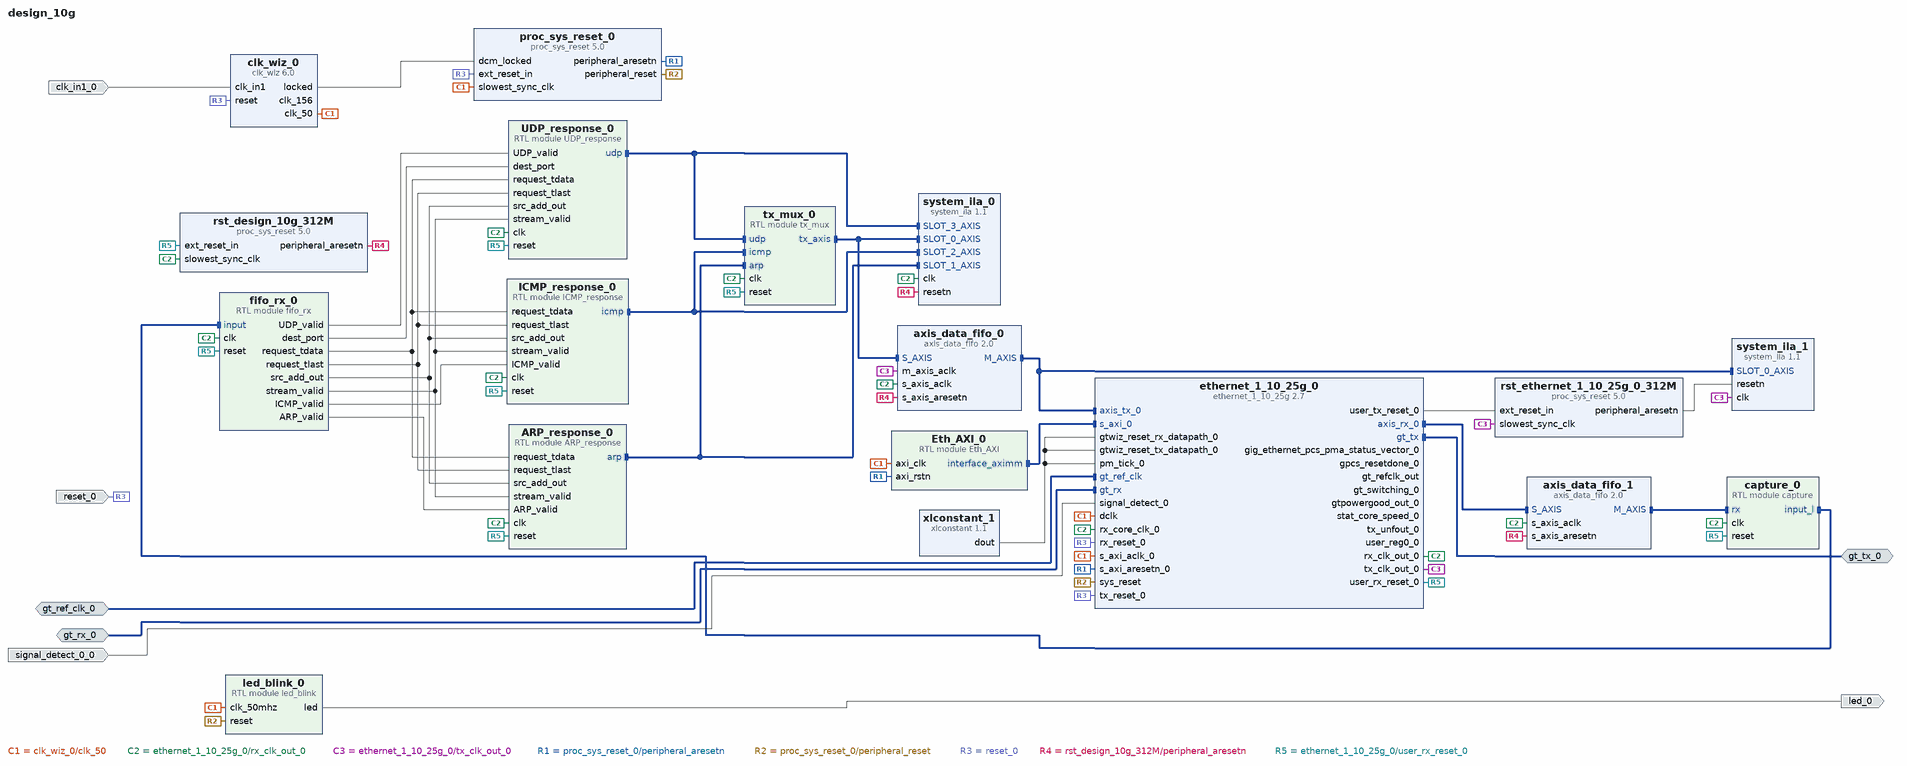
[diagram p0: block diagram of the top level]
# Vivado block design design_10g, xcku085-flvf1924-2-i, Vivado 2021.1
create_bd_design design_10g

create_bd_intf_port -mode Slave -vlnv xilinx.com:interface:diff_clock_rtl:1.0 gt_ref_clk_0
set_property -dict {CONFIG.FREQ_HZ 156250000} [get_bd_intf_ports gt_ref_clk_0]
create_bd_intf_port -mode Slave -vlnv xilinx.com:display_ethernet_1_10_25g:gt_ports:2.0 gt_rx_0
create_bd_intf_port -mode Master -vlnv xilinx.com:display_ethernet_1_10_25g:gt_ports:2.0 gt_tx_0
create_bd_port -dir I -type rst reset_0
set_property -dict {CONFIG.POLARITY ACTIVE_HIGH} [get_bd_ports reset_0]
create_bd_port -dir O led_0
create_bd_port -dir I -type clk clk_in1_0
set_property -dict {CONFIG.FREQ_HZ 20000000} [get_bd_ports clk_in1_0]
create_bd_port -dir I signal_detect_0_0

create_bd_cell -type ip -vlnv xilinx.com:ip:clk_wiz:6.0 clk_wiz_0
set_property -dict [list \
  CONFIG.CLKIN1_JITTER_PS 500.0 \
  CONFIG.CLKOUT1_JITTER 198.455 \
  CONFIG.CLKOUT1_PHASE_ERROR 309.974 \
  CONFIG.CLKOUT1_REQUESTED_OUT_FREQ 156.250 \
  CONFIG.CLKOUT2_JITTER 225.529 \
  CONFIG.CLKOUT2_PHASE_ERROR 309.974 \
  CONFIG.CLKOUT2_REQUESTED_OUT_FREQ 50.000 \
  CONFIG.CLKOUT2_USED true \
  CONFIG.CLK_OUT1_PORT clk_156 \
  CONFIG.CLK_OUT2_PORT clk_50 \
  CONFIG.MMCM_CLKFBOUT_MULT_F 62.500 \
  CONFIG.MMCM_CLKIN1_PERIOD 50.000 \
  CONFIG.MMCM_CLKIN2_PERIOD 10.0 \
  CONFIG.MMCM_CLKOUT0_DIVIDE_F 8.000 \
  CONFIG.MMCM_CLKOUT1_DIVIDE 25 \
  CONFIG.MMCM_DIVCLK_DIVIDE 1 \
  CONFIG.NUM_OUT_CLKS 2 \
  CONFIG.PRIM_IN_FREQ 20.000 \
  CONFIG.PRIM_SOURCE Single_ended_clock_capable_pin \
] [get_bd_cells clk_wiz_0]
create_bd_cell -type ip -vlnv xilinx.com:ip:ethernet_1_10_25g:2.7 ethernet_1_10_25g_0
set_property -dict [list \
  CONFIG.ADD_GT_CNTRL_STS_PORTS 0 \
  CONFIG.CORE {Ethernet MAC+PCS/PMA 32-bit} \
  CONFIG.GT_DRP_CLK 50.00 \
  CONFIG.GT_GROUP_SELECT Quad_X0Y4 \
  CONFIG.LANE1_GT_LOC X0Y19 \
] [get_bd_cells ethernet_1_10_25g_0]
create_bd_cell -type ip -vlnv xilinx.com:ip:proc_sys_reset:5.0 proc_sys_reset_0
create_bd_cell -type ip -vlnv xilinx.com:ip:xlconstant:1.1 xlconstant_1
set_property -dict {CONFIG.CONST_VAL 0} [get_bd_cells xlconstant_1]
create_bd_cell -type ip -vlnv xilinx.com:ip:proc_sys_reset:5.0 rst_design_10g_312M
create_bd_cell -type module -reference led_blink led_blink_0
create_bd_cell -type ip -vlnv xilinx.com:ip:proc_sys_reset:5.0 rst_ethernet_1_10_25g_0_312M
create_bd_cell -type ip -vlnv xilinx.com:ip:system_ila:1.1 system_ila_0
set_property -dict [list \
  CONFIG.ALL_PROBE_SAME_MU_CNT 2 \
  CONFIG.C_EN_STRG_QUAL 1 \
  CONFIG.C_MON_TYPE INTERFACE \
  CONFIG.C_NUM_MONITOR_SLOTS 4 \
  CONFIG.C_NUM_OF_PROBES 1 \
  CONFIG.C_PROBE0_MU_CNT 2 \
  CONFIG.C_PROBE0_TYPE 0 \
  CONFIG.C_PROBE1_TYPE 0 \
  CONFIG.C_PROBE2_TYPE 0 \
  CONFIG.C_PROBE3_TYPE 0 \
  CONFIG.C_PROBE4_TYPE 0 \
  CONFIG.C_PROBE5_TYPE 0 \
  CONFIG.C_SLOT_0_APC_EN 0 \
  CONFIG.C_SLOT_0_AXI_DATA_SEL 1 \
  CONFIG.C_SLOT_0_AXI_TRIG_SEL 1 \
  CONFIG.C_SLOT_0_INTF_TYPE xilinx.com:interface:axis_rtl:1.0 \
  CONFIG.C_SLOT_0_TYPE 0 \
  CONFIG.C_SLOT_1_APC_EN 0 \
  CONFIG.C_SLOT_1_AXI_DATA_SEL 1 \
  CONFIG.C_SLOT_1_AXI_TRIG_SEL 1 \
  CONFIG.C_SLOT_1_INTF_TYPE xilinx.com:interface:axis_rtl:1.0 \
  CONFIG.C_SLOT_2_APC_EN 0 \
  CONFIG.C_SLOT_2_AXI_DATA_SEL 1 \
  CONFIG.C_SLOT_2_AXI_TRIG_SEL 1 \
  CONFIG.C_SLOT_2_INTF_TYPE xilinx.com:interface:axis_rtl:1.0 \
  CONFIG.C_SLOT_3_APC_EN 0 \
  CONFIG.C_SLOT_3_AXI_DATA_SEL 1 \
  CONFIG.C_SLOT_3_AXI_TRIG_SEL 1 \
  CONFIG.C_SLOT_3_INTF_TYPE xilinx.com:interface:axis_rtl:1.0 \
] [get_bd_cells system_ila_0]
create_bd_cell -type ip -vlnv xilinx.com:ip:axis_data_fifo:2.0 axis_data_fifo_0
set_property -dict {CONFIG.IS_ACLK_ASYNC 1} [get_bd_cells axis_data_fifo_0]
create_bd_cell -type ip -vlnv xilinx.com:ip:axis_data_fifo:2.0 axis_data_fifo_1
create_bd_cell -type module -reference ARP_response ARP_response_0
create_bd_cell -type module -reference ICMP_response ICMP_response_0
create_bd_cell -type module -reference Eth_AXI Eth_AXI_0
create_bd_cell -type module -reference capture capture_0
create_bd_cell -type module -reference fifo_rx fifo_rx_0
create_bd_cell -type module -reference tx_mux tx_mux_0
create_bd_cell -type ip -vlnv xilinx.com:ip:system_ila:1.1 system_ila_1
set_property -dict [list \
  CONFIG.C_MON_TYPE INTERFACE \
  CONFIG.C_NUM_MONITOR_SLOTS 1 \
  CONFIG.C_SLOT_0_APC_EN 1 \
  CONFIG.C_SLOT_0_AXI_DATA_SEL 1 \
  CONFIG.C_SLOT_0_AXI_TRIG_SEL 1 \
  CONFIG.C_SLOT_0_INTF_TYPE xilinx.com:interface:axis_rtl:1.0 \
] [get_bd_cells system_ila_1]
create_bd_cell -type module -reference UDP_response UDP_response_0

# ---- connections ----

connect_bd_intf_net -intf_net ARP_response_0_arp [get_bd_intf_pins tx_mux_0/arp] [get_bd_intf_pins ARP_response_0/arp]
connect_bd_intf_net [get_bd_intf_pins tx_mux_0/arp] [get_bd_intf_pins system_ila_0/SLOT_1_AXIS]
connect_bd_intf_net [get_bd_intf_pins Eth_AXI_0/interface_aximm] [get_bd_intf_pins ethernet_1_10_25g_0/s_axi_0]
connect_bd_intf_net -intf_net ICMP_response_0_icmp [get_bd_intf_pins tx_mux_0/icmp] [get_bd_intf_pins ICMP_response_0/icmp]
connect_bd_intf_net [get_bd_intf_pins tx_mux_0/icmp] [get_bd_intf_pins system_ila_0/SLOT_2_AXIS]
connect_bd_intf_net -intf_net UDP_response_0_udp [get_bd_intf_pins tx_mux_0/udp] [get_bd_intf_pins UDP_response_0/udp]
connect_bd_intf_net [get_bd_intf_pins tx_mux_0/udp] [get_bd_intf_pins system_ila_0/SLOT_3_AXIS]
connect_bd_intf_net -intf_net axis_data_fifo_0_M_AXIS [get_bd_intf_pins axis_data_fifo_0/M_AXIS] [get_bd_intf_pins ethernet_1_10_25g_0/axis_tx_0]
connect_bd_intf_net [get_bd_intf_pins axis_data_fifo_0/M_AXIS] [get_bd_intf_pins system_ila_1/SLOT_0_AXIS]
connect_bd_intf_net [get_bd_intf_pins axis_data_fifo_1/M_AXIS] [get_bd_intf_pins capture_0/rx]
connect_bd_intf_net [get_bd_intf_pins fifo_rx_0/input] [get_bd_intf_pins capture_0/input_l]
connect_bd_intf_net [get_bd_intf_pins axis_data_fifo_1/S_AXIS] [get_bd_intf_pins ethernet_1_10_25g_0/axis_rx_0]
connect_bd_intf_net [get_bd_intf_ports gt_tx_0] [get_bd_intf_pins ethernet_1_10_25g_0/gt_tx]
connect_bd_intf_net -intf_net gt_ref_clk_0_1 [get_bd_intf_ports gt_ref_clk_0] [get_bd_intf_pins ethernet_1_10_25g_0/gt_ref_clk]
connect_bd_intf_net -intf_net gt_rx_0_1 [get_bd_intf_ports gt_rx_0] [get_bd_intf_pins ethernet_1_10_25g_0/gt_rx]
connect_bd_intf_net -intf_net tx_mux_0_tx_axis [get_bd_intf_pins axis_data_fifo_0/S_AXIS] [get_bd_intf_pins tx_mux_0/tx_axis]
connect_bd_intf_net [get_bd_intf_pins axis_data_fifo_0/S_AXIS] [get_bd_intf_pins system_ila_0/SLOT_0_AXIS]
connect_bd_net -net clk_in1_0_1 [get_bd_ports clk_in1_0] [get_bd_pins clk_wiz_0/clk_in1]
connect_bd_net [get_bd_pins clk_wiz_0/clk_50] \
  [get_bd_pins ethernet_1_10_25g_0/dclk] [get_bd_pins ethernet_1_10_25g_0/s_axi_aclk_0] \
  [get_bd_pins proc_sys_reset_0/slowest_sync_clk] [get_bd_pins led_blink_0/clk_50mhz] [get_bd_pins Eth_AXI_0/axi_clk]
# net clk_wiz_0_clk_156 has one end: clk_wiz_0/clk_156
connect_bd_net [get_bd_pins clk_wiz_0/locked] [get_bd_pins proc_sys_reset_0/dcm_locked]
connect_bd_net [get_bd_pins ethernet_1_10_25g_0/rx_clk_out_0] \
  [get_bd_pins ethernet_1_10_25g_0/rx_core_clk_0] [get_bd_pins rst_design_10g_312M/slowest_sync_clk] \
  [get_bd_pins system_ila_0/clk] [get_bd_pins axis_data_fifo_0/s_axis_aclk] [get_bd_pins axis_data_fifo_1/s_axis_aclk] \
  [get_bd_pins ARP_response_0/clk] [get_bd_pins ICMP_response_0/clk] [get_bd_pins capture_0/clk] [get_bd_pins fifo_rx_0/clk] \
  [get_bd_pins tx_mux_0/clk] [get_bd_pins UDP_response_0/clk]
connect_bd_net [get_bd_pins ethernet_1_10_25g_0/tx_clk_out_0] \
  [get_bd_pins rst_ethernet_1_10_25g_0_312M/slowest_sync_clk] [get_bd_pins axis_data_fifo_0/m_axis_aclk] \
  [get_bd_pins system_ila_1/clk]
connect_bd_net [get_bd_pins fifo_rx_0/ARP_valid] [get_bd_pins ARP_response_0/ARP_valid]
connect_bd_net [get_bd_pins fifo_rx_0/ICMP_valid] [get_bd_pins ICMP_response_0/ICMP_valid]
connect_bd_net [get_bd_pins fifo_rx_0/UDP_valid] [get_bd_pins UDP_response_0/UDP_valid]
connect_bd_net [get_bd_pins fifo_rx_0/dest_port] [get_bd_pins UDP_response_0/dest_port]
connect_bd_net [get_bd_pins fifo_rx_0/request_tdata] \
  [get_bd_pins ARP_response_0/request_tdata] [get_bd_pins ICMP_response_0/request_tdata] \
  [get_bd_pins UDP_response_0/request_tdata]
connect_bd_net [get_bd_pins fifo_rx_0/request_tlast] \
  [get_bd_pins ARP_response_0/request_tlast] [get_bd_pins ICMP_response_0/request_tlast] \
  [get_bd_pins UDP_response_0/request_tlast]
connect_bd_net [get_bd_pins fifo_rx_0/src_add_out] \
  [get_bd_pins ARP_response_0/src_add_out] [get_bd_pins ICMP_response_0/src_add_out] [get_bd_pins UDP_response_0/src_add_out]
connect_bd_net [get_bd_pins fifo_rx_0/stream_valid] \
  [get_bd_pins ARP_response_0/stream_valid] [get_bd_pins ICMP_response_0/stream_valid] \
  [get_bd_pins UDP_response_0/stream_valid]
# net gig_ethernet_pcs_pma_status_vector_0 has one end: ethernet_1_10_25g_0/gig_ethernet_pcs_pma_status_vector_0
# net gpcs_resetdone_0 has one end: ethernet_1_10_25g_0/gpcs_resetdone_0
# net gt_refclk_out has one end: ethernet_1_10_25g_0/gt_refclk_out
# net gt_switching_0 has one end: ethernet_1_10_25g_0/gt_switching_0
# net gtpowergood_out_0 has one end: ethernet_1_10_25g_0/gtpowergood_out_0
connect_bd_net [get_bd_pins led_blink_0/led] [get_bd_ports led_0]
connect_bd_net [get_bd_pins proc_sys_reset_0/peripheral_aresetn] [get_bd_pins ethernet_1_10_25g_0/s_axi_aresetn_0] [get_bd_pins Eth_AXI_0/axi_rstn]
connect_bd_net [get_bd_pins proc_sys_reset_0/peripheral_reset] [get_bd_pins ethernet_1_10_25g_0/sys_reset] [get_bd_pins led_blink_0/reset]
connect_bd_net -net reset_0_1 [get_bd_ports reset_0] \
  [get_bd_pins clk_wiz_0/reset] [get_bd_pins ethernet_1_10_25g_0/tx_reset_0] [get_bd_pins proc_sys_reset_0/ext_reset_in] \
  [get_bd_pins ethernet_1_10_25g_0/rx_reset_0]
connect_bd_net [get_bd_pins rst_design_10g_312M/peripheral_aresetn] \
  [get_bd_pins axis_data_fifo_1/s_axis_aresetn] [get_bd_pins system_ila_0/resetn] \
  [get_bd_pins axis_data_fifo_0/s_axis_aresetn]
connect_bd_net [get_bd_pins rst_ethernet_1_10_25g_0_312M/peripheral_aresetn] [get_bd_pins system_ila_1/resetn]
connect_bd_net -net signal_detect_0_0_1 [get_bd_ports signal_detect_0_0] [get_bd_pins ethernet_1_10_25g_0/signal_detect_0]
# net stat_core_speed_0 has one end: ethernet_1_10_25g_0/stat_core_speed_0
# net tx_unfout_0 has one end: ethernet_1_10_25g_0/tx_unfout_0
# net user_reg0_0 has one end: ethernet_1_10_25g_0/user_reg0_0
connect_bd_net -net user_rx_reset_0 [get_bd_pins ethernet_1_10_25g_0/user_rx_reset_0] \
  [get_bd_pins ARP_response_0/reset] [get_bd_pins ICMP_response_0/reset] [get_bd_pins rst_design_10g_312M/ext_reset_in] \
  [get_bd_pins capture_0/reset] [get_bd_pins fifo_rx_0/reset] [get_bd_pins tx_mux_0/reset] [get_bd_pins UDP_response_0/reset]
connect_bd_net -net user_tx_reset_0 [get_bd_pins ethernet_1_10_25g_0/user_tx_reset_0] [get_bd_pins rst_ethernet_1_10_25g_0_312M/ext_reset_in]
connect_bd_net [get_bd_pins xlconstant_1/dout] \
  [get_bd_pins ethernet_1_10_25g_0/gtwiz_reset_tx_datapath_0] [get_bd_pins ethernet_1_10_25g_0/gtwiz_reset_rx_datapath_0] \
  [get_bd_pins ethernet_1_10_25g_0/pm_tick_0]
set_property HDL_ATTRIBUTE.DEBUG true [get_bd_intf_nets ARP_response_0_arp]
set_property HDL_ATTRIBUTE.MARK_DEBUG true [get_bd_intf_nets ARP_response_0_arp]
set_property HDL_ATTRIBUTE.DEBUG true [get_bd_intf_nets ICMP_response_0_icmp]
set_property HDL_ATTRIBUTE.MARK_DEBUG true [get_bd_intf_nets ICMP_response_0_icmp]
set_property HDL_ATTRIBUTE.DEBUG true [get_bd_intf_nets UDP_response_0_udp]
set_property HDL_ATTRIBUTE.MARK_DEBUG true [get_bd_intf_nets UDP_response_0_udp]
set_property HDL_ATTRIBUTE.DEBUG true [get_bd_intf_nets axis_data_fifo_0_M_AXIS]
set_property HDL_ATTRIBUTE.MARK_DEBUG true [get_bd_intf_nets axis_data_fifo_0_M_AXIS]
set_property HDL_ATTRIBUTE.DEBUG true [get_bd_intf_nets tx_mux_0_tx_axis]
set_property HDL_ATTRIBUTE.MARK_DEBUG true [get_bd_intf_nets tx_mux_0_tx_axis]

# ---- address map ----
assign_bd_address -offset 0x44A00000 -range 64K -target_address_space [get_bd_addr_spaces Eth_AXI_0/interface_aximm] [get_bd_addr_segs ethernet_1_10_25g_0/s_axi_0/Reg]

validate_bd_design
save_bd_design
